# EAGLE design node_worker (EAGLE 9.0.0)
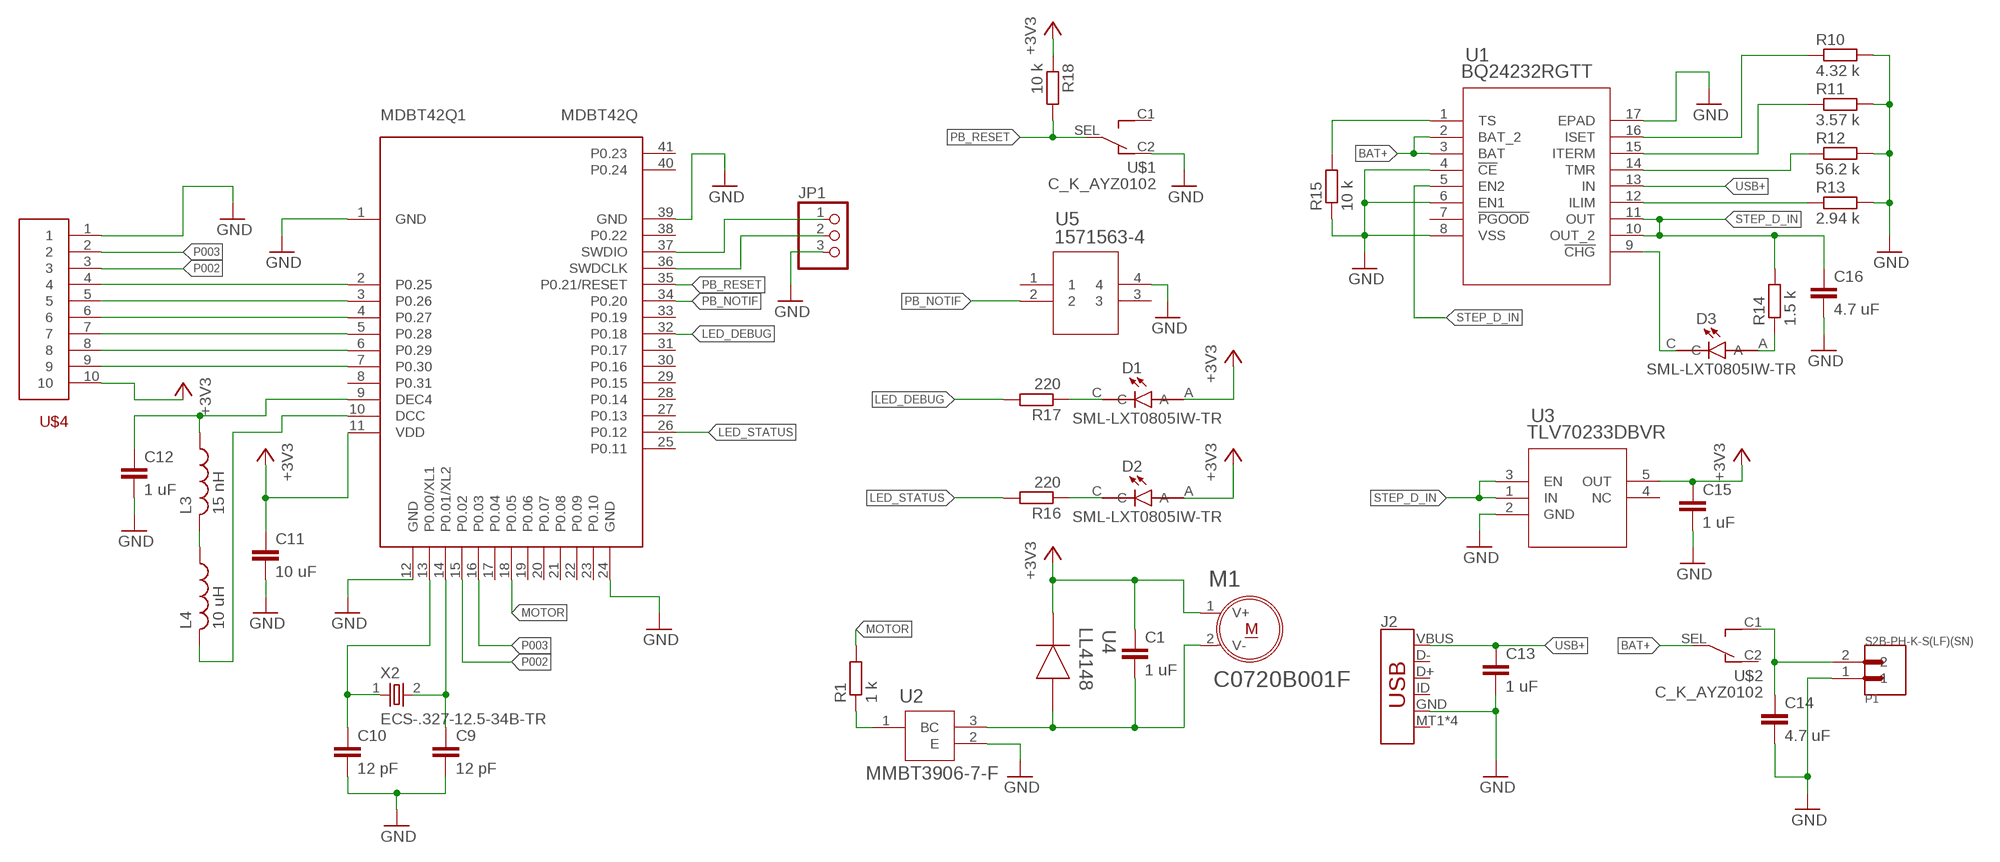
[diagram p0: schematic, sheet 1]

## Parts
C1  1 uF  C-EUC0603  [C0603]
C9  12 pF  C-EUC0603  [C0603]
C10  12 pF  C-EUC0603  [C0603]
C11  10 uF  C-EUC0603  [C0603]
C12  1 uF  C-EUC0603  [C0603]
C13  1 uF  C-EUC0603  [C0603]
C14  4.7 uF  C-EUC0603  [C0603]
C15  1 uF  C-EUC0603  [C0603]
C16  4.7 uF  C-EUC0603  [C0603]
D1  SML-LXT0805IW-TR  [LEDC2012X120N]
D2  SML-LXT0805IW-TR  [LEDC2012X120N]
D3  SML-LXT0805IW-TR  [LEDC2012X120N]
J2  USB_MICRO-B_SMT  [USB-MICROB]
JP1  PINHD-1X3  [1X03]
L3  15 nH  L-USL0603  [L0603]
L4  10 uH  L-USL0603  [L0603]
M1  C0720B001F  [XDCR_C0720B001F]
MDBT42Q1  MDBT42Q  [MDBT42Q]
P1  S2B-PH-K-S(LF)(SN)  [JST_S2B-PH-K-S(LF)(SN)]
R1  1 k  R-EU_R0603  [R0603]
R10  4.32 k  R-EU_R0603  [R0603]
R11  3.57 k  R-EU_R0603  [R0603]
R12  56.2 k  R-EU_R0603  [R0603]
R13  2.94 k  R-EU_R0603  [R0603]
R14  1.5 k  R-EU_R0603  [R0603]
R15  10 k  R-EU_R0603  [R0603]
R16  220  R-EU_R0603  [R0603]
R17  220  R-EU_R0603  [R0603]
R18  10 k  R-EU_R0603  [R0603]
U1  BQ24232RGTT  [RGT16_1P7X1P7]
U2  MMBT3906-7-F  [SOT-23]
U3  TLV70233DBVR  [DBV5]
U4  LL4148  [SOD-80]
U5  1571563-4  [SWITCH_1571563-4]
U$1  C_K_AYZ0102  [C_K_AYZ0102]
U$2  C_K_AYZ0102  [C_K_AYZ0102]
U$4  MOLEX_FPC_10  [MOLEX_FPC_10]
X2  ECS-.327-12.5-34B-TR  [XTAL_ECS-.327-12.5-34B-C-TR]

## Nets
+3V3: C1.1 C11.1 C15.1 D1.A D2.A M1.1(V+) MDBT42Q1.11(VDD) R18.1 U3.5(OUT) U4.CATH U$4.10
BAT+: U1.2(BAT_2) U1.3(BAT) U$2.SEL
GND: C9.2 C10.2 C11.2 C12.2 C13.2 C14.2 C15.2 C16.2 J2.GND JP1.3 MDBT42Q1.1(GND) MDBT42Q1.12(GND) MDBT42Q1.24(GND) MDBT42Q1.39(GND) P1.1 R10.2 R11.2 R12.2 R13.2 R15.1 U1.4(!CE) U1.6(EN1) U1.8(VSS) U1.17(EPAD) U2.2(E) U3.2(GND) U5.4 U$1.C2 U$4.1
LED_DEBUG: MDBT42Q1.32(P0.18) R17.2
LED_STATUS: MDBT42Q1.26(P0.12) R16.2
MOTOR: MDBT42Q1.18(P0.05) R1.2
N$1: C9.1 MDBT42Q1.14(P0.01/XL2) X2.2
N$2: L4.2 MDBT42Q1.10(DCC)
N$3: L3.2 L4.1
N$4: R11.1 U1.15(ITERM)
N$5: C10.1 MDBT42Q1.13(P0.00/XL1) X2.1
N$6: JP1.2 MDBT42Q1.36(SWDCLK)
N$7: JP1.1 MDBT42Q1.37(SWDIO)
N$9: MDBT42Q1.7(P0.30) U$4.9
N$10: MDBT42Q1.6(P0.29) U$4.8
N$11: MDBT42Q1.5(P0.28) U$4.7
N$12: D1.C R17.1
N$13: D3.C U1.9(!CHG)
N$14: R13.1 U1.12(ILIM)
N$15: C12.1 L3.1 MDBT42Q1.9(DEC4)
N$16: D3.A R14.1
N$17: R12.1 U1.14(TMR)
N$18: D2.C R16.1
N$19: R10.1 U1.16(ISET)
N$20: R15.2 U1.1(TS)
N$21: C14.1 P1.2 U$2.C1
N$22: R1.1 U2.1(B)
N$23: MDBT42Q1.4(P0.27) U$4.6
N$24: C1.2 M1.2(V-) U2.3(C) U4.ANO
N$25: MDBT42Q1.3(P0.26) U$4.5
N$26: MDBT42Q1.2(P0.25) U$4.4
P002: MDBT42Q1.15(P0.02) U$4.3
P003: MDBT42Q1.16(P0.03) U$4.2
PB_NOTIF: MDBT42Q1.34(P0.20) U5.2
PB_RESET: MDBT42Q1.35(P0.21/RESET) R18.2 U$1.SEL
STEP_D_IN: C16.1 R14.2 U1.5(EN2) U1.10(OUT_2) U1.11(OUT) U3.1(IN) U3.3(EN)
USB+: C13.1 J2.VBUS U1.13(IN)
Unconnected: J2.D+ J2.D- J2.ID J2.MT1(SHIELD) J2.MT2(SHIELD) J2.P$1(SHIELD) J2.P$2(SHIELD) MDBT42Q1.8(P0.31) MDBT42Q1.17(P0.04) MDBT42Q1.19(P0.06) MDBT42Q1.20(P0.07) MDBT42Q1.21(P0.08) MDBT42Q1.22(P0.09) MDBT42Q1.23(P0.10) MDBT42Q1.25(P0.11) MDBT42Q1.27(P0.13) MDBT42Q1.28(P0.14) MDBT42Q1.29(P0.15) MDBT42Q1.30(P0.16) MDBT42Q1.31(P0.17) MDBT42Q1.33(P0.19) MDBT42Q1.38(P0.22) MDBT42Q1.40(P0.24) MDBT42Q1.41(P0.23) U1.7(!PGOOD) U3.4(NC) U5.1 U5.3 U$1.C1 U$2.C2

## Library data of the parts
C1 C9-C16 = resistor:C-EU: CAPACITOR, European symbol
D1-D3 = led_red:SML-LXT0805IW-TR: LED; Luminous Intensity:11µcd; Viewing Angle:140°; Forward Current:30mA; Forward Voltage:2V; Color:Red; LED Color:Red; Leaded Process Compatible:Yes; Lens Color:White; Mounting Type:Surface Mount ;RoHS Compliant: Yes; DESCRIPTION: LED; Red; 11mcd; 0.061In.Dia.; SMD; 100mA; 2VVf; 635nm; 140deg; SMD; White Diffused; 5V Vr; DIGI-KEY_PART_NUMBER: 67-1552-1-ND; DIGI-KEY_PURCHASE_URL: https://www.digikey.com/product-detail/en/lumex-opto-components-inc/SML-LXT0805IW-TR/67-1552-1-ND/304366?WT.z_cid=ref_snapeda&utm_source=snapeda&utm_medium=aggregator&utm_campaign=buynow; MF: Lumex; MP: SML-LXT0805IW-TR; PACKAGE: 0805 Lumex
J2 = SparkFun-Connectors:USB_MICRO-B: USB Type Micro-B Connector Male/female and PTH/SMT variants SparkFun Products: SparkFun microB USB Breakout <https://www.sparkfun.com/products/12035> SparkFun USB microB Plug Breakout <https://www.sparkfun.com/products/10031> SparkFun ESP8266 Thing <https://www.sparkfun.com/products/13231>; PROD_ID: CONN-09505; SF_ID: PRT-08533
JP1 = pinhead:PINHD-1X3: PIN HEADER
L3 L4 = rcl:L-US: INDUCTOR, American symbol
M1 = vibration_motor:C0720B001F: Vibration Motor Coin 3v Flex; DESCRIPTION: Vibration Motor Coin 3v Flex; DIGI-KEY_PART_NUMBER: 1670-1000-ND; DIGI-KEY_PURCHASE_URL: https://www.digikey.com/product-detail/en/jinlong-machinery-electronics-inc/C0720B001F/1670-1000-ND/6009905?WT.z_cid=ref_snapeda&utm_source=snapeda&utm_medium=aggregator&utm_campaign=buynow; MF: Jinlong Machinery & Electronics; MP: C0720B001F; PACKAGE: Jinlong Machinery &amp; Electronics
MDBT42Q1 = MDBT42Q_171016:MDBT42Q: Raytac Corporation MDBT42Q-512K, MDBT42Q-P512K Bluetooth Low Energy Module based on Noridc nRF52832 Source: Raytac datasheet
P1 = battery_conn:S2B-PH-K-S(LF)(SN): PH Series 2 Position 2.0 mm Through Hole Side Entry Shrouded Header; AVAILABILITY: Good; DESCRIPTION: PH Series 2 Position 2.0 mm Through Hole Side Entry Shrouded Header; MF: JST; MP: S2B-PH-K-S_LF__SN_; PACKAGE: FakePackage u; PRICE: 0.07 USD
R1 R10-R18 = resistor:R-EU_: RESISTOR, European symbol
U1 = BQ24232:BQ24232RGTT; MANUFACTURER_PART_NUMBER: BQ24232RGTT; VENDOR: Texas Instruments
U2 = BJT_MMBT3906:MMBT3906-7-F; MANUFACTURER_PART_NUMBER: MMBT39067F; VENDOR: Diodes Inc
U3 = LDO_TLV70233:TLV70233DBVR; MANUFACTURER_PART_NUMBER: TLV70233DBVR; VENDOR: Texas Instruments
U4 = diode_4148:LL4148; MANUFACTURER_PART_NUMBER: LL4148; VENDOR: Fairchild Semiconductor
U5 = push_button_ALCOSWITCH:1571563-4; MANUFACTURER_PART_NUMBER: 15715634; VENDOR: TE Connectivity
U$1 U$2 = switch:C_K_AYZ0102
U$4 = molex_p5_0527461071:MOLEX_FPC_10
X2 = xtal_32kHz:ECS-.327-12.5-34B-TR: Crystal 2-SMD, No Lead; DESCRIPTION: Crystal 0.032768MHz ±20ppm _Tol_ 12.5pF Flexural 70000Ohm 2-Pin Mini-SMD T/R; DIGI-KEY_PART_NUMBER: XC1617CT-ND; DIGI-KEY_PURCHASE_URL: https://www.digikey.com/product-detail/en/ecs-inc/ECS-.327-12.5-34B-TR/XC1617CT-ND/1693786?WT.z_cid=ref_snapeda&utm_source=snapeda&utm_medium=aggregator&utm_campaign=buynow; MF: ECS International; MP: ECS-.327-12.5-34B-TR; PACKAGE: SMD-2 ECS International

## Board
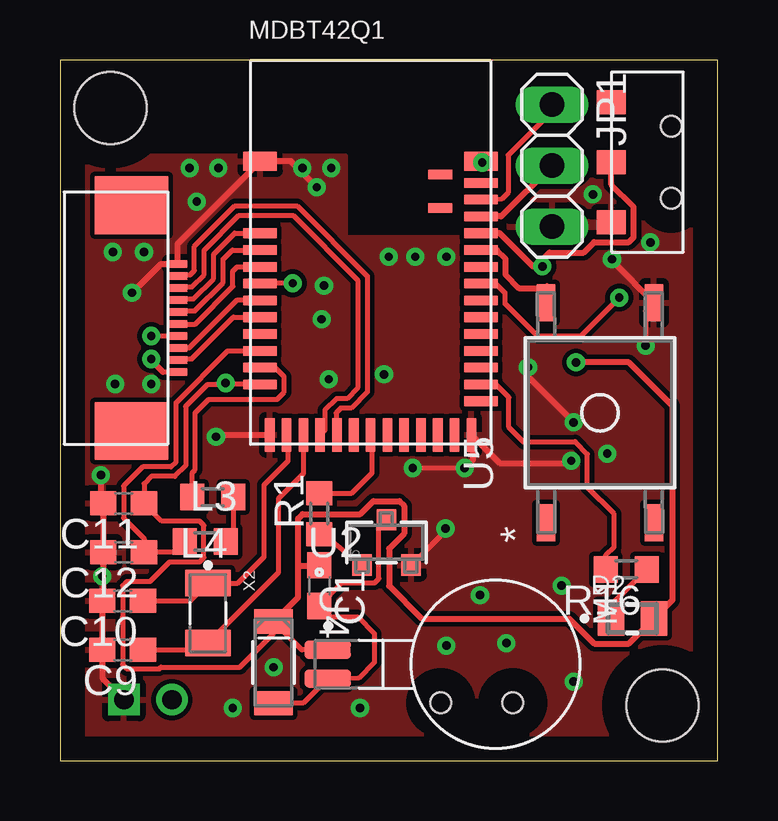
[diagram p1: board, top side]
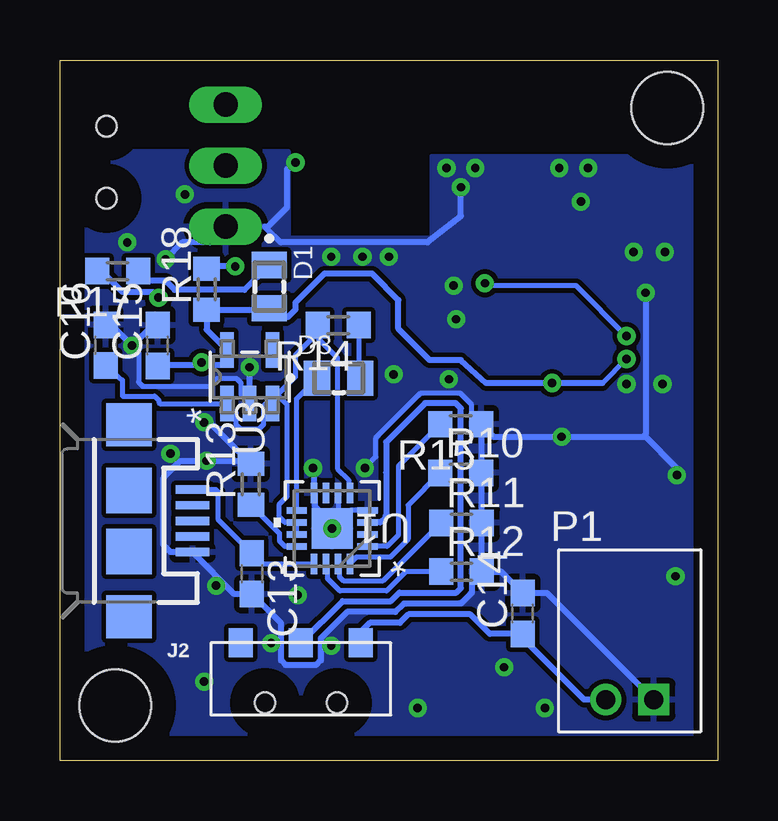
[diagram p2: board, bottom side, seen from below]

Size 27.4 x 29.2 mm. Coordinates in mm from the lower left corner, seen from the top.
Outline: 0,0 27.4,0 27.4,29.2 0,29.2 0,0
Copper layers (1*16): Top 0.035mm / dielectric 1.5mm / Bottom 0.035mm
Design rules "default *": minimum track width 0.2mm, minimum drill 0.35mm, track to track 0.2mm, track to pad 0.2mm, pad to pad 0.2mm, via to via 0.2mm, smd to smd 0.2mm, copper to edge 40mil, drill to drill 6mil, minimum pad ring 10mil, minimum via ring 8mil, stop-mask expansion 4mil, vias tented up to drill 0mil, thermal gap 10mil
Holes 3 mm at 25.1,2.3 2.1,27.2

### Footprints (pad centres in the part's own frame; a part is rotated, then mirrored left to right if it is on the bottom)
C0603 = smd 1.1 x 1: 1 -0.85,0; 2 0.85,0
LEDC2012X120N = smd 1.1 x 1.45: A 0.9,0; C -0.9,0
USB-MICROB = smd 1.4 x 0.35: D+ -2.65,0; D- -2.65,-0.65; GND -2.65,1.3; ID -2.65,0.65; VBUS -2.65,-1.3 | smd 1.9 x 1.8: MT1 0,-4; MT2 0,4 | smd 1.9 x 1.9: P$1 0,-1.27; P$2 0,1.27
1X03 = drill 1.016 long: 1 -2.54,0; 2 0,0; 3 2.54,0
L0603 = smd 1 x 1.1: 1 -0.85,0; 2 0.85,0
XDCR_C0720B001F = smd 0.76 x 1.94: 1 -0.6,-5.02; 2 0.6,-5.02
MDBT42Q = smd 1.4 x 0.8: 1 -4.6,3.8; 39 4.6,3.8 | smd 1.4 x 0.4: 2 -4.6,0.8; 3 -4.6,0.1; 4 -4.6,-0.6; 5 -4.6,-1.3; 6 -4.6,-2; 7 -4.6,-2.7; 8 -4.6,-3.4; 9 -4.6,-4.1; 10 -4.6,-4.8; 11 -4.6,-5.5; 25 4.6,-6.2; 26 4.6,-5.5; 27 4.6,-4.8; 28 4.6,-4.1; 29 4.6,-3.4; 30 4.6,-2.7; 31 4.6,-2; 32 4.6,-1.3; 33 4.6,-0.6; 34 4.6,0.1; 35 4.6,0.8; 36 4.6,1.5; 37 4.6,2.2; 38 4.6,2.9 | smd 0.4 x 1.4: 12 -4.2,-7.6; 13 -3.5,-7.6; 14 -2.8,-7.6; 15 -2.1,-7.6; 16 -1.4,-7.6; 17 -0.7,-7.6; 18 0,-7.6; 19 0.7,-7.6; 20 1.4,-7.6; 21 2.1,-7.6; 22 2.8,-7.6; 23 3.5,-7.6; 24 4.2,-7.6 | smd 1 x 0.4: 40 2.9,3.25; 41 2.9,1.85
JST_S2B-PH-K-S(LF)(SN) = drill 0.8 square: 1 1,0 | drill 0.8: 2 -1,0
R0603 = smd 1 x 1.1: 1 -0.85,0; 2 0.85,0
RGT16_1P7X1P7 = smd 0.85 x 0.28: 1 -1.475,0.75; 2 -1.475,0.25; 3 -1.475,-0.25; 4 -1.475,-0.75; 9 1.475,-0.75; 10 1.475,-0.25; 11 1.475,0.25; 12 1.475,0.75 | smd 0.28 x 0.85: 5 -0.75,-1.475; 6 -0.25,-1.475; 7 0.25,-1.475; 8 0.75,-1.475; 13 0.75,1.475; 14 0.25,1.475; 15 -0.25,1.475; 16 -0.75,1.475 | smd 1.7 x 1.7: 17 0,0
SOT-23 = smd 0.813 x 0.889: 1 -1.025,-0.945; 2 1.025,-0.945; 3 0,0.945
DBV5 = smd 1.473 x 0.559: 1 -1.118,0.95; 2 -1.118,0; 3 -1.118,-0.95; 4 1.118,-0.95; 5 1.118,0.95
SOD-80 = smd 1.016 x 1.6: ANO 1.702,0; CATH -1.702,0
SWITCH_1571563-4 = smd 1.549 x 0.762: 1 -4.585,2.248; 2 4.585,2.248; 3 -4.585,-2.248; 4 4.585,-2.248
C_K_AYZ0102 = smd 1 x 1.2: C1 -2.22,-1.27; C2 2.78,-1.27; SEL 0.28,-1.27 | hole 0.85: -1.22,1.23; 1.78,1.23
MOLEX_FPC_10 = smd 0.3 x 0.8: 1 -2,2.9; 2 -1.5,2.9; 3 -1,2.9; 4 -0.5,2.9; 5 0,2.9; 6 0.5,2.9; 7 1,2.9; 8 1.5,2.9; 9 2,2.9; 10 2.5,2.9 | smd 2.4 x 3.05: S1 -4.45,0.975; S2 4.95,0.975
XTAL_ECS-.327-12.5-34B-C-TR = smd 1.1 x 1.9: 1 -1.25,0; 2 1.25,0

### Placement (x,y rotation side)
C1  10.8,7.3 270 top
C9  2.61,4.63 180 top
C10  2.61,6.67 180 top
C11  2.65,10.73 180 top
C12  2.65,8.7 180 top
C13  19.41,7.8 270 bottom
C14  8.13,6.14 90 bottom
C15  23.33,17.3 90 bottom
C16  25.5,17.32 90 bottom
D1  18.69,19.75 270 bottom
D2  23.85,5.93 0 top
D3  15.79,15.94 0 bottom
J2  24.53,10 180 bottom
JP1  20.5,24.8 270 top
L3  6.05,9.14 0 top
L4  6.36,10.99 180 top
M1  16.18,4.03 270 top
MDBT42Q1  12.94,21.18 0 top
P1  3.66,2.55 0 bottom
R1  10.8,10.3 90 top
R10  10.71,11.99 0 bottom
R11  10.68,9.91 0 bottom
R12  10.68,7.88 0 bottom
R13  19.45,11.52 90 bottom
R14  15.81,18.16 180 bottom
R15  10.71,14.02 180 bottom
R16  23.6,7.98 180 top
R17  25,20.4 180 bottom
R18  21.3,19.65 90 bottom
U1  16.07,9.68 180 bottom
U2  13.6,9.1 0 top
U3  19.5,16 90 bottom
U4  8.9,4.1 270 top
U5  22.5,14.5 90 top
U$1  24.24,25.22 270 top
U$2  17.08,3.65 180 bottom
U$4  2,18.7 270 top
X2  6.16,6.15 270 top

### Tracks (layer width: path | path; a pad name or v marks a point on that pad's centre or on a via)
+3V3  (via drill 0.35)
  Top 0.2: 8.33,15.67 MDBT42Q1.11 6.96,15.68 v6.9,15.74 6.84,15.68 6.15,15.68 5.23,14.76 5.23,12.29 4.79,11.85 3.8,11.85 3.5,11.55 C11.1 4.25,9.99 5.82,9.99 6,9.81 6,8.46 5.82,8.29 4.57,8.29 3.75,7.47 2.79,7.47 2.61,7.3 2.61,5.99 | 2.6,6 2.61,5.99 | 2.61,5.99 2.61,4.01 2.79,3.83 4.14,3.83 4.21,3.9 7.5,3.9 | 7.5,3.9 | 9.2,5.61 U4.CATH | M1.1 10.08,4.62 U4.CATH | 24.3,5.93 D2.A 24.81,5.99 | 7.5,3.9 8.9,5.31 U4.CATH | U$4.10 4.3,16.2 | 3.8,16.7 v3.8,16.74
  Top 0.254: v21.5,16.6 23.7,16.6 25.52,14.79 25.52,6.7 24.81,5.99 23.7,4.88 22.27,4.88 21.22,5.93 15.07,5.93 13.71,7.29 13.71,8.84 14.33,9.46 14.33,10.62 14.14,10.82 13.06,10.82 12.52,10.28 10.12,10.28 9.92,10.09 9.92,8.1 | U4.CATH 9.92,6.83 9.92,8.1 | C1.1 10.75,8.1 9.92,8.1 | 4.3,16.2 3.8,16.7
  Bottom 0.2: C15.1 23.19,16.5 | 20.5,16.5 20.5,17.07 U3.5 | v21.5,16.6 21.5,16.5 | v3.8,16.74 4.8,15.74
  Bottom 0.254: 23.19,16.5 21.5,16.5 20.5,16.5 | 4.8,15.74 v6.9,15.74 9.65,15.74 10.7,16.7 12,16.7 13.3,18 13.3,19.2 14.39,20.3 16.39,20.3 17.6,19.09 17.6,18.8 17.9,18.5 18.33,18.5 D1.A 18.75,18.8 R18.1 21.3,17.96 U3.5
BAT+
  Bottom 0.2: 13.81,12 13.8,11.99
  Bottom 0.254: 13.81,12 13.81,13.28 12.19,14.9 10.92,14.9 10.7,14.68 10.7,7.2 10.89,7 13.27,7 13.62,6.65 15.63,6.65 U$2.SEL | 13.8,11.99 13.8,10.23 13.84,10.19 13.84,10.16 14.06,9.93 U1.3 U1.2
GND  (via drill 0.35)
  Top 0.2: 1.8,6.71 C10.2 | v6.5,13.5 6.58,13.58 | 17.21,13.51 MDBT42Q1.24 17.2,13.64 17.2,14.1 | 1.7,10.83 C11.2 | U5.4 24.4,18.74 v24.4,17.3 | U2.2 16,9.53 16,9.62 U1.17 | v16.86,12.2 v14.7,12.2 | v17.59,24.93 MDBT42Q1.39 arc90 v17.59,24.93
  Top 0.254: C11.2 C12.2 1.8,6.71 | C10.2 C9.2 1.76,3.45 P1.1 | 6.58,13.58 MDBT42Q1.12 | v3,19.5 4.2,20.7 U$4.1 4.9,21.54 MDBT42Q1.1 9.62,24.98 v10.7,23.9 | v21.3,12.5 21.2,12.4 18.32,12.4 17.21,13.51 17.21,12.55 v16.86,12.2 | v1.7,11.9 1.7,10.83 | v19.5,16.4 19.5,16 v21.4,14.1 | v23,20.9 23,20.83 U5.4 | U$1.C2 22.79,22.26 | MDBT42Q1.39 17.82,24.98
  Bottom 0.2: 3,13.59 3.05,13.55 | R13.2 19.5,12.42 19.5,12.5 | C15.2 23.38,18.01 23.69,18.01 | 16.82,10.43 16.64,10.26 U1.17 | U1.6 15.81,9.93 U1.17 | U1.4 15.32,10.43 U1.17 | 25.27,18.17 C16.2 | v24.4,17.3 24.13,17.03 24.13,15.78 23.96,15.6 21.17,15.6 20.85,15.92 20.05,15.92 19.87,15.74 19.87,15.25 U3.2 | 16.82,12.08 16.8,12.1 16.8,12.14 v16.86,12.2 | R11.2 9.86,9.94 | v21.4,14.1 21.1,14.1 | v14.7,12.2 14.24,12.66 14.24,13.46 12.37,15.33 10.74,15.33 10.27,14.86 10.27,14.44 R15.1 | 17.94,24.66 17.86,24.66 v17.59,24.93
  Bottom 0.254: v3,19.5 3,13.59 | 9.86,9.94 R10.2 R15.1 9.33,13.5 v6.5,13.5 3.09,13.5 3.05,13.55 1.7,12.2 v1.7,11.9 | 19.5,12.5 v21.3,12.5 22.4,12.5 23.1,11.8 23.1,9 22.8,8.7 J2.GND 20.14,6.95 C13.2 18.19,5.74 18.19,4.18 18,3.99 16.73,3.99 16.54,4.18 16.54,5.1 15.44,6.2 13.43,6.2 13.08,6.55 10.71,6.55 10.25,7.01 10.25,7.46 R12.2 | P1.1 7.1,6.99 C14.2 9.02,7.88 R12.2 | 23.69,18.01 v24.4,17.3 25.27,18.17 | 16.82,12.08 U1.8 16.78,11.12 16.78,10.6 16.64,10.46 16.64,10.26 | R12.2 R11.2 | U3.2 v19.5,16.4 | v10.7,23.9 10.7,22.7 12.1,21.6 18.2,21.6 18.8,22.2 | R13.2 21.18,14.1 v21.4,14.1 | 18.8,22.2 18.86,22.26 | 21.16,21.6 22.3,21.6 v23,20.9 | 18.8,22.2 17.94,23.06 17.94,24.66
  other vias: 16.07,9.68 13.5,16.1 6.6,24.7 14.8,21 17.5,6.9 20.9,7.3 8.9,3.9 22.8,12.8 3.8,15.7 1.76,7.69 13.7,21 16.1,21 5.4,24.7 11.3,24.7 10.1,24.7 5.7,23.3 10.9,18.4 11.2,15.9 7.2,2.2 22.2,23.6 24.6,21.6 11,19.8 2.3,15.7 3.5,21.2 2.2,21.2 12.5,2.2 21.4,3.3 18.6,4.9 16.1,4.8
  pour Bottom: 0.1,0.1 27.4,0.1 27.4,25.4 17.9,25.4 17.9,21.8 11.9,21.8 11.9,25.2 0.1,25.2
  pour Top: 0.1,25.2 0.1,0.2 27.4,0.2 27.4,25.4 18.7,25.4 18.7,21.8 11.9,21.8 11.9,25.2
LED_DEBUG  (via drill 0.35)
  Top 0.2: 18.12,19.88 MDBT42Q1.32 18.16,19.88 18.54,19.51 18.54,19.06 18.85,18.75 19.9,17.7 21.7,17.7 v23.3,19.3
  Bottom 0.254: v23.3,19.3 23.53,19.53 24.79,19.53 25.67,20.4 R17.2
LED_STATUS
  Top 0.2: R16.2 22.74,8.56 23.09,8.91 23.09,10.29 21.98,11.39 21.98,12.78 21.48,13.28 | 21.48,13.28 21.46,13.3 | 21.48,13.28 19.32,13.28 18.7,13.9 18.7,15.15 18.16,15.68 MDBT42Q1.26
MOTOR
  Top 0.2: R1.2 12.15,11.15 13,12 13,13.52 MDBT42Q1.18
N$1
  Top 0.2: C9.1 5.89,4.63 X2.2 8.68,7.42 8.8,7.55 9.1,7.84 9.1,10.92 10.14,11.96 MDBT42Q1.14
N$2
  Top 0.2: 8.38,16.42 MDBT42Q1.10 8.96,16.38 9.34,16.01 9.34,15.36 9.04,15.06 6.2,15.06 5.63,14.5 5.63,12.13 5.51,12.01 L4.2
N$3
  Top 0.2: L4.1 7.21,9.45 L3.2
N$4
  Bottom 0.2: U1.15 15.76,8.15 15.76,7.66 15.58,7.48 13.96,7.48 R11.1
N$5
  Top 0.2: MDBT42Q1.13 9.5,13.52 9.5,12.5 8.5,11.5 8.5,8.5 7.4,7.4 X2.1 5.43,6.67 C10.1
N$6
  Top 0.254: JP1.2 18.38,22.68 MDBT42Q1.36
N$7
  Top 0.2: JP1.1 20.5,27.06 18.68,25.24 18.68,23.68 18.4,23.4 MDBT42Q1.37
N$9
  Top 0.2: U$4.9 4.95,16.75 5.49,16.75 7.22,18.48 MDBT42Q1.7
N$10
  Top 0.2: U$4.8 5.37,17.2 7.36,19.18 MDBT42Q1.6
N$11  (via drill 0.35)
  Top 0.2: U$4.7 v3.8,17.7 | v9.7,19.9 8.36,19.9 MDBT42Q1.5
  Bottom 0.2: v3.8,17.7 5.9,19.8 9.8,19.8 9.9,19.9 v9.7,19.9
N$12
  Bottom 0.254: R17.1 23.75,20 23.01,20 22.63,19.62 19.72,19.62 D1.C
N$13
  Bottom 0.2: U1.9 17.54,15.1 D3.C
N$14
  Bottom 0.2: R13.1 18.27,9.49 18.27,9.17 18.03,8.93 U1.12
N$15
  Top 0.2: 3.5,9 C12.1 4.76,8.7 L3.1 | 3.83,9 3.5,9 | 3.5,9 3.5,9.26 2.65,10.11 2.65,11.45 3.45,12.25 4.62,12.25 4.83,12.46 4.83,14.93 6.99,17.08 MDBT42Q1.9
N$16
  Bottom 0.2: D3.A 14.96,15.78 14.96,15.79 R14.1
N$17
  Bottom 0.2: R12.1 12.99,7.88 13.79,7.08 15.74,7.08 16.25,7.59 16.25,8.15 U1.14
N$18
  Top 0.2: R16.1 22.95,6.47 D2.C
N$19
  Bottom 0.2: U1.16 15.31,8.23 15.06,8.49 13.64,8.49 12.9,9.23 12.9,10.65 R10.1
N$20
  Bottom 0.2: 14.53,8.99 U1.1 13.77,8.93 13.7,9 13.3,9.4 13.3,12.28 R15.2
N$21
  Bottom 0.2: C14.1 8.3,5.29
  Bottom 0.254: P1.2 5.56,2.55 8.3,5.29 9.49,5.29 10.3,6.1 12.89,6.1 13.24,5.75 14.5,5.75 14.86,5.38 U$2.C1
N$22
  Top 0.2: R1.1 10.88,9.53 U2.1
N$23
  Top 0.2: U$4.6 5.64,18.2 7.2,19.76 7.2,20.4 7.38,20.58 MDBT42Q1.4
N$24
  Top 0.2: U4.ANO 10.13,2.4 M1.2 12.44,3.44 13.1,4.1 13.1,5.3 12.4,6 11.25,6 C1.2 11.76,7.41 13.11,7.41 13.28,7.59 13.28,9.73 U2.3
N$25
  Top 0.2: U$4.5 4.95,18.75 5.62,18.75 6.8,19.93 6.8,20.9 7.18,21.28 MDBT42Q1.3
N$26
  Top 0.2: U$4.4 4.95,19.25 5.56,19.25 6.4,20.09 6.4,21.1 7.28,21.98 MDBT42Q1.2
P002
  Top 0.2: U$4.3 4.95,19.75 5.49,19.75 6,20.26 6,21.27 7.45,22.72 9.71,22.72 12.4,20.03 12.4,15.54 11.96,15.1 11.53,15.1 11.04,14.61 11.04,13.78 MDBT42Q1.15
P003
  Top 0.2: MDBT42Q1.16 11.5,13.62 11.5,14.5 11.7,14.7 12.13,14.7 12.8,15.37 12.8,20.2 9.88,23.12 7.29,23.12 5.6,21.43 5.6,20.43 5.42,20.25 4.95,20.25 U$4.2
PB_NOTIF
  Top 0.2: MDBT42Q1.34 17.7,21.28 18.06,21.28 | 20.3,19.8 20.25,19.75 20.25,19.7 U5.2
  Top 0.254: 20.25,19.7 19.12,19.7 18.57,20.25 18.57,20.92 18.2,21.28 17.7,21.28
PB_RESET  (via drill 0.35)
  Top 0.254: MDBT42Q1.35 18.32,21.98 19.7,20.6 v20.1,20.6 20,20.6 19.9,20.5 19.9,20.68 20.39,21.17 21.81,21.17 22.25,21.61 23.7,21.61 23.9,21.8 23.9,23.07 22.97,24 U$1.SEL
  Bottom 0.254: v20.1,20.6 21.19,20.6 R18.2
STEP_D_IN
  Bottom 0.2: U1.11 U1.10 18.03,9.93 18.27,10.17 18.27,10.7 17.94,11.02 17.94,14.84 18.35,15.25 | 18.55,15.04 U3.3 | 18.35,15.25 17.59,16 17.59,16.91 16.66,17.84 R14.2 16.66,17.61 15.84,16.79 15.84,12.17 15.38,11.71 15.38,11.22 U1.5 | 18.35,15.25 18.55,15.04 | C16.1 24.8,15.86 24.8,15.2 23.46,15.2 23.28,15.02 23.28,14.92 23.25,14.88 U3.1 20.08,14.51 20.08,14.02 19.9,13.85 19.1,13.85 18.92,14.02 18.92,14.8 18.68,15.04 18.55,15.04
USB+
  Bottom 0.2: U1.13 18.97,8.21 C13.1 20.8,10.04 20.8,11.2 20.9,11.3 J2.VBUS